# EAGLE design extensometro (EAGLE 9.0.0)
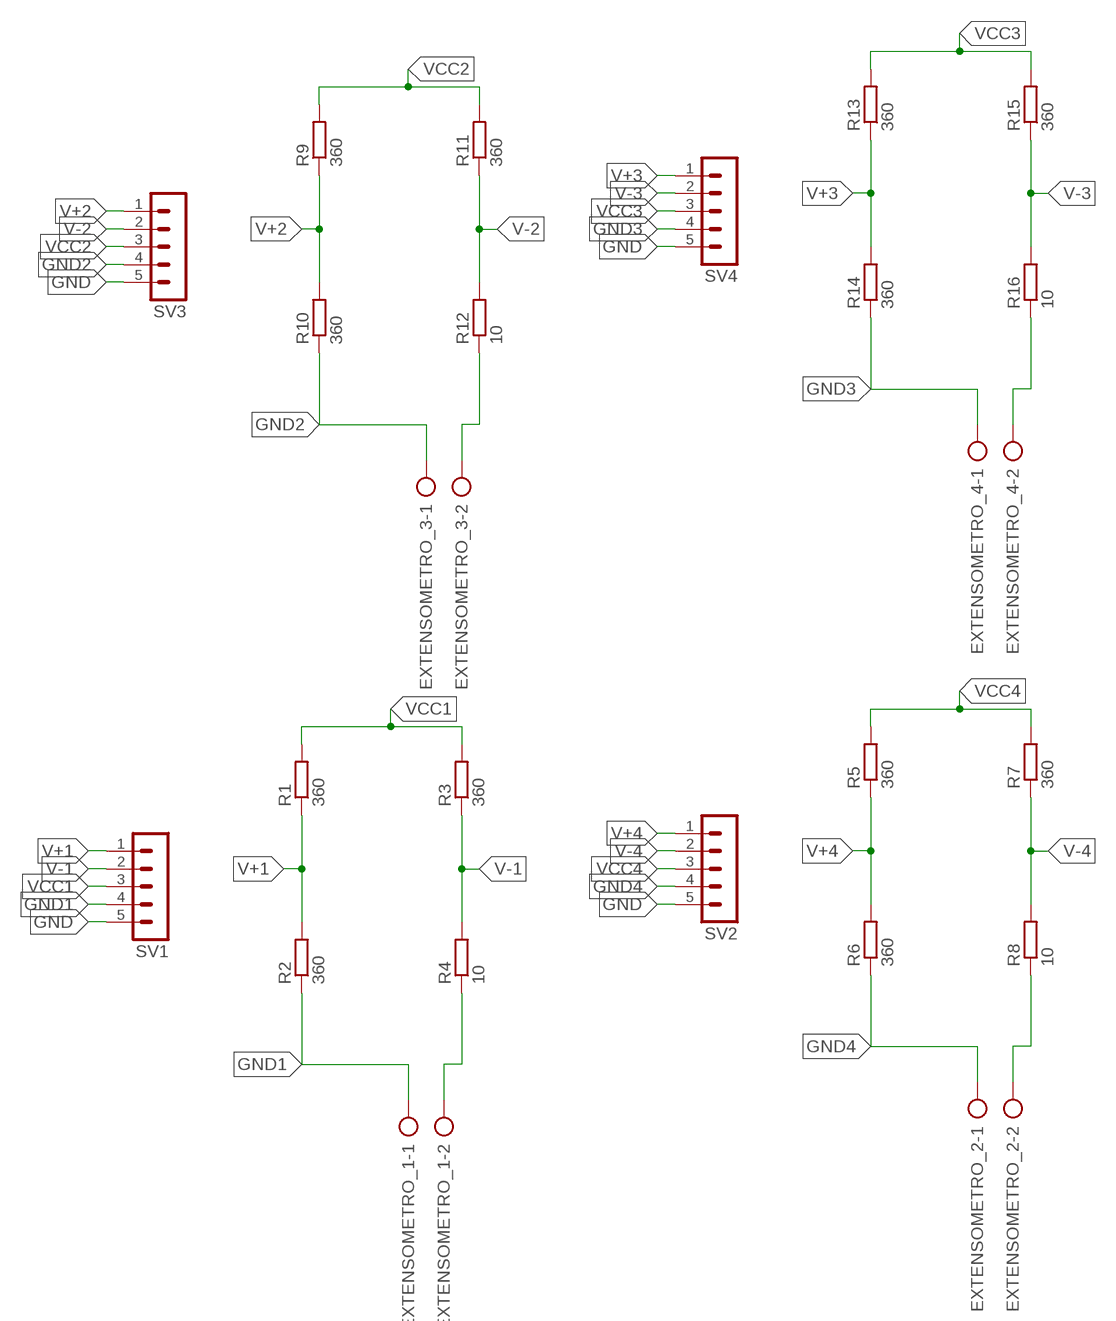
[diagram p0: schematic, sheet 1]

## Parts
EXTENSOMETRO_1  AK500/2  [AK500/2]
EXTENSOMETRO_2  AK500/2  [AK500/2]
EXTENSOMETRO_3  AK500/2  [AK500/2]
EXTENSOMETRO_4  AK500/2  [AK500/2]
R1  360  R-EU_0207/7  [0207/7]
R2  360  R-EU_0207/7  [0207/7]
R3  360  R-EU_0207/7  [0207/7]
R4  10  R-EU_0207/7  [0207/7]
R5  360  R-EU_0207/7  [0207/7]
R6  360  R-EU_0207/7  [0207/7]
R7  360  R-EU_0207/7  [0207/7]
R8  10  R-EU_0207/7  [0207/7]
R9  360  R-EU_0207/7  [0207/7]
R10  360  R-EU_0207/7  [0207/7]
R11  360  R-EU_0207/7  [0207/7]
R12  10  R-EU_0207/7  [0207/7]
R13  360  R-EU_0207/7  [0207/7]
R14  360  R-EU_0207/7  [0207/7]
R15  360  R-EU_0207/7  [0207/7]
R16  10  R-EU_0207/7  [0207/7]
SV1  MA05-1  [MA05-1]
SV2  MA05-1  [MA05-1]
SV3  MA05-1  [MA05-1]
SV4  MA05-1  [MA05-1]

## Nets
GND: SV1.5 SV2.5 SV3.5 SV4.5
GND1: EXTENSOMETRO_1.1 R2.1 SV1.4
GND2: EXTENSOMETRO_3.1 R10.1 SV3.4
GND3: EXTENSOMETRO_4.1 R14.1 SV4.4
GND4: EXTENSOMETRO_2.1 R6.1 SV2.4
N$1: EXTENSOMETRO_2.2 R8.1
N$2: EXTENSOMETRO_1.2 R4.1
N$3: EXTENSOMETRO_3.2 R12.1
N$4: EXTENSOMETRO_4.2 R16.1
V+1: R1.1 R2.2 SV1.1
V+2: R9.1 R10.2 SV3.1
V+3: R13.1 R14.2 SV4.1
V+4: R5.1 R6.2 SV2.1
V-1: R3.1 R4.2 SV1.2
V-2: R11.1 R12.2 SV3.2
V-3: R15.1 R16.2 SV4.2
V-4: R7.1 R8.2 SV2.2
VCC1: R1.2 R3.2 SV1.3
VCC2: R9.2 R11.2 SV3.3
VCC3: R13.2 R15.2 SV4.3
VCC4: R5.2 R7.2 SV2.3

## Library data of the parts
EXTENSOMETRO_1-EXTENSOMETRO_4 = con-ptr500:AK500/2: CONNECTOR; OC_FARNELL: unknown; OC_NEWARK: unknown
R1-R16 = rcl:R-EU_: RESISTOR, European symbol; SPICEPREFIX: R
SV1-SV4 = con-lstb:MA05-1: PIN HEADER; OC_FARNELL: unknown; OC_NEWARK: unknown

## Board
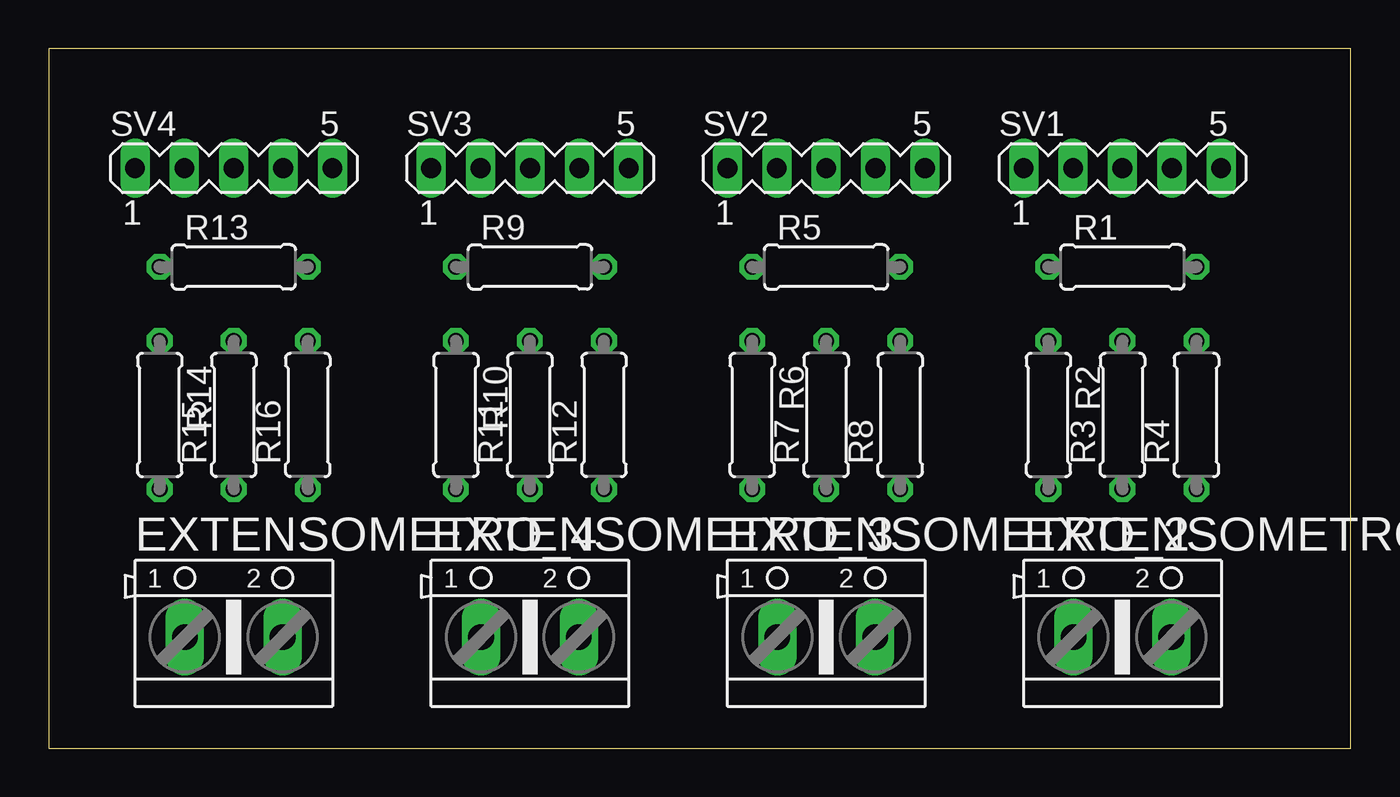
[diagram p1: board, top side]
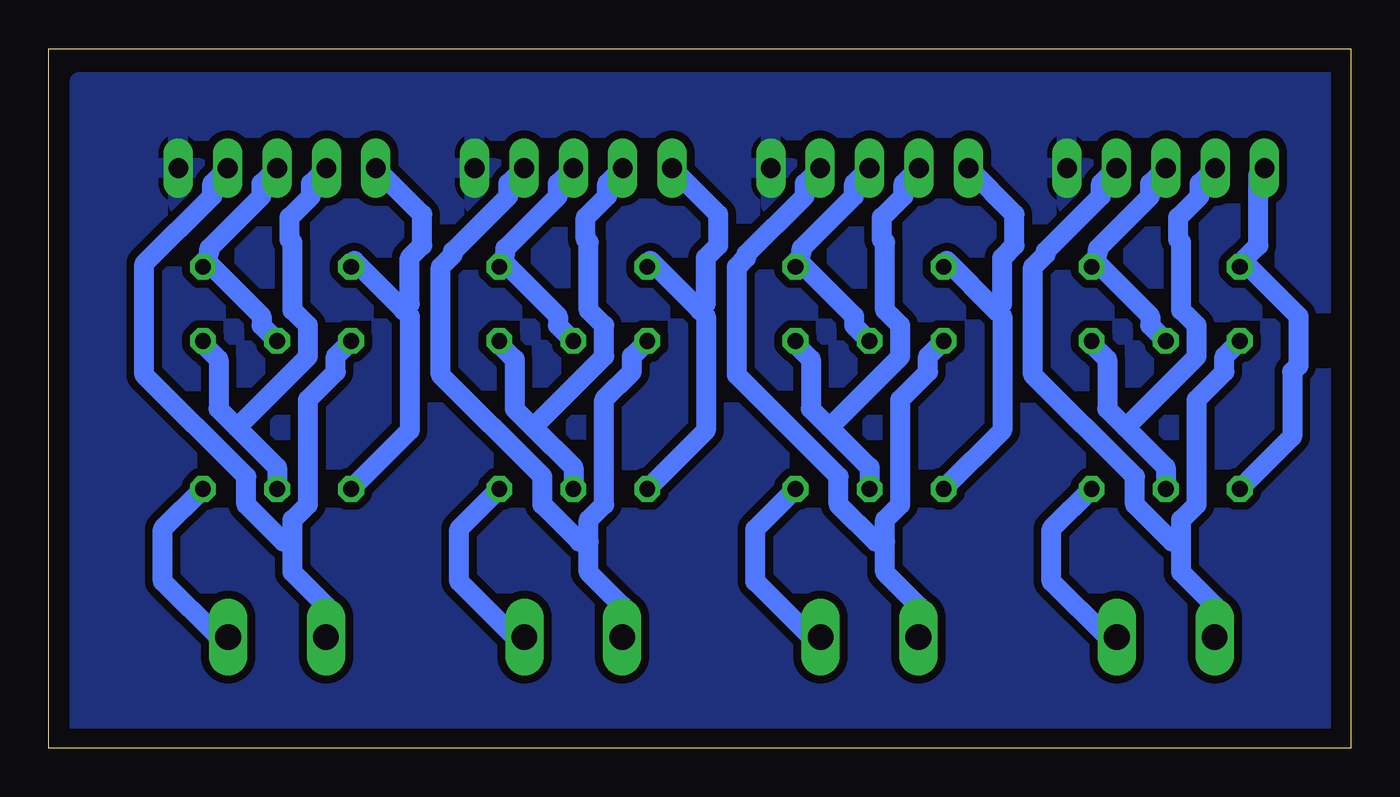
[diagram p2: board, bottom side, seen from below]

Size 67 x 36 mm. Coordinates in mm from the lower left corner, seen from the top.
Outline: 0,0 67,0 67,36 0,36 0,0
Copper layers (1*16): Top 0.035mm / dielectric 1.5mm / Bottom 0.035mm
Design rules "default *": minimum track width 40mil, minimum drill 0.35mm, track to track 16mil, track to pad 16mil, pad to pad 16mil, via to via 16mil, smd to smd 6mil, copper to edge 40mil, drill to drill 6mil, minimum pad ring 10mil, minimum via ring 8mil, stop-mask expansion 4mil, vias tented up to drill 0mil, thermal gap 10mil

### Footprints (pad centres in the part's own frame; a part is rotated, then mirrored left to right if it is on the bottom)
AK500/2 = drill 1.321 long: 1 -2.515,0; 2 2.515,0
0207/7 = drill 0.813 octagon: 1 -3.81,0; 2 3.81,0
MA05-1 = drill 1.016 long: 1 -5.08,0; 2 -2.54,0; 3 0,0; 4 2.54,0; 5 5.08,0

### Placement (x,y rotation side)
EXTENSOMETRO_1  55.24,5.71 0 top
EXTENSOMETRO_2  40.01,5.71 0 top
EXTENSOMETRO_3  24.77,5.71 0 top
EXTENSOMETRO_4  9.53,5.71 0 top
R1  55.24,24.77 0 top
R2  51.44,17.14 270 top
R3  55.24,17.14 90 top
R4  59.05,17.14 90 top
R5  40.01,24.77 0 top
R6  36.2,17.14 270 top
R7  40.01,17.14 90 top
R8  43.81,17.14 90 top
R9  24.77,24.77 0 top
R10  20.95,17.14 270 top
R11  24.77,17.14 90 top
R12  28.57,17.14 90 top
R13  9.53,24.77 0 top
R14  5.71,17.14 270 top
R15  9.53,17.14 90 top
R16  13.34,17.14 90 top
SV1  55.24,29.84 0 top
SV2  40.01,29.84 0 top
SV3  24.77,29.84 0 top
SV4  9.53,29.84 0 top

### Tracks (layer width: path | path; a pad name or v marks a point on that pad's centre or on a via)
GND
  pour Bottom: 0,34.29 0,0.64 -0.64,0 65.41,0 65.41,34.29
GND1
  Bottom 1.016: R2.1 52.23,20.16 52.23,19.37 53.66,17.94 53.66,12.54 54.45,11.75 54.45,10.64 | 54.45,10.64 54.45,9.05 52.7,7.3 52.7,5.71 EXTENSOMETRO_1.1 | SV1.4 58.58,29.05 58.58,28.42 62.07,24.92 62.07,19.21 56.83,13.97 56.83,12.54 54.93,10.64 54.45,10.64
GND2
  Bottom 1.016: R10.1 21.75,20.16 21.75,19.37 23.18,17.94 23.18,12.54 23.97,11.75 23.97,10.64 | 23.97,10.64 23.97,9.05 22.23,7.3 22.23,5.71 EXTENSOMETRO_3.1 | SV3.4 28.1,29.05 28.1,28.42 31.11,25.4 31.11,25.24 31.59,24.77 31.59,19.21 26.35,13.97 26.35,12.54 24.45,10.64 23.97,10.64
GND3
  Bottom 1.016: R14.1 6.51,20.16 6.51,19.37 7.94,17.94 7.94,12.54 8.73,11.75 8.73,10.64 | 8.73,10.64 8.73,9.05 6.99,7.3 6.99,5.71 EXTENSOMETRO_4.1 | SV4.4 12.86,29.05 12.86,28.42 15.72,25.56 15.72,25.4 16.35,24.77 16.35,19.21 11.11,13.97 11.11,12.54 9.21,10.64 8.73,10.64
GND4
  Bottom 1.016: R6.1 36.99,20.16 36.99,19.37 38.42,17.94 38.42,12.54 39.21,11.75 39.21,10.64 | 39.21,10.64 39.21,9.05 37.47,7.3 37.47,5.71 EXTENSOMETRO_2.1 | SV2.4 43.34,29.05 43.34,28.42 46.2,25.56 46.2,25.4 46.83,24.77 46.83,19.21 41.59,13.97 41.59,12.54 39.69,10.64 39.21,10.64
N$1
  Bottom 1.016: R8.1 45.88,11.27 45.88,8.57 43.02,5.71 EXTENSOMETRO_2.2
N$2
  Bottom 1.016: R4.1 61.12,11.27 61.12,8.57 58.26,5.71 EXTENSOMETRO_1.2
N$3
  Bottom 1.016: R12.1 30.64,11.27 30.64,8.57 27.78,5.71 EXTENSOMETRO_3.2
N$4
  Bottom 1.016: R16.1 15.4,11.27 15.4,8.57 12.54,5.71 EXTENSOMETRO_4.2
N$5
  pour Bottom: 1.27,34.29 1.27,1.27 65.41,1.27 65.41,34.29
V+1
  Bottom 1.016: R2.2 48.42,16.35 48.42,22.23 48.74,22.54 | 48.74,22.54 51.28,25.08 51.44,24.92 R1.1 | SV1.1 47.78,27.46 47.78,25.88 48.42,25.24 48.42,22.86 48.74,22.54
V+2
  Bottom 1.016: R10.2 17.94,16.35 17.94,22.23 18.26,22.54 | 18.26,22.54 20.8,25.08 20.95,24.92 R9.1 | SV3.1 17.3,27.46 17.3,25.88 17.94,25.24 17.94,22.86 18.26,22.54
V+3
  Bottom 1.016: R14.2 3.02,16.03 3.02,19.37 2.7,19.68 2.7,22.23 5.56,25.08 | 5.56,25.08 5.71,24.92 R13.1 | SV4.1 4.76,29.53 4.76,25.88 5.56,25.08
V+4
  Bottom 1.016: R6.2 33.18,16.35 33.18,22.23 33.5,22.54 | 33.5,22.54 36.04,25.08 36.2,24.92 R5.1 | SV2.1 32.54,27.46 32.54,25.88 33.18,25.24 33.18,22.86 33.5,22.54
V-1
  Bottom 1.016: R3.1 55.24,14.45 57.31,16.51 | 57.31,16.51 58.26,17.46 58.26,20 59.05,20.8 R4.2 | SV1.2 53.5,29.05 53.5,28.42 54.61,27.3 54.61,26.19 54.45,26.04 54.45,22.54 53.66,21.75 53.66,20.16 57.31,16.51
V-2
  Bottom 1.016: R11.1 24.77,14.45 26.83,16.51 | 26.83,16.51 27.78,17.46 27.78,20 28.57,20.8 R12.2 | SV3.2 23.02,29.05 23.02,28.42 24.13,27.3 24.13,26.19 23.97,26.04 23.97,22.54 23.18,21.75 23.18,20.16 26.83,16.51
V-3
  Bottom 1.016: R15.1 9.53,14.45 11.59,16.51 | 11.59,16.51 12.54,17.46 12.54,20 13.34,20.8 R16.2 | SV4.2 7.78,29.05 7.78,28.42 8.89,27.3 8.89,26.19 8.73,26.04 8.73,22.54 7.94,21.75 7.94,20.16 11.59,16.51
V-4
  Bottom 1.016: R7.1 40.01,14.45 42.07,16.51 | 42.07,16.51 43.02,17.46 43.02,20 43.81,20.8 R8.2 | SV2.2 38.26,29.05 38.26,28.42 39.37,27.3 39.37,26.19 39.21,26.04 39.21,22.54 38.42,21.75 38.42,20.16 42.07,16.51
VCC1
  Bottom 1.016: R3.2 56.04,21.75 56.04,22.23 58.9,25.08 | 58.9,25.08 59.05,24.92 R1.2 | SV1.3 56.04,29.05 56.04,28.42 58.74,25.72 58.74,25.56 58.9,25.08
VCC2
  Bottom 1.016: R11.2 25.56,21.75 25.56,22.23 28.42,25.08 | 28.42,25.08 28.57,24.92 R9.2 | SV3.3 25.56,29.05 25.56,28.42 28.26,25.72 28.26,25.56 28.42,25.08
VCC3
  Bottom 1.016: R15.2 10.32,21.75 10.32,22.23 13.18,25.08 | 13.18,25.08 13.34,24.92 R13.2 | SV4.3 10.32,29.05 10.32,28.42 13.02,25.72 13.02,25.56 13.18,25.08
VCC4
  Bottom 1.016: R7.2 40.8,21.75 40.8,22.23 43.66,25.08 | 43.66,25.08 43.81,24.92 R5.2 | SV2.3 40.8,29.05 40.8,28.42 43.5,25.72 43.5,25.56 43.66,25.08